# Altium schematic sheet HT1-1-Top.SchDoc: Top
size A3; Author: daniw; SheetNumber: 1; SheetTotal: 10
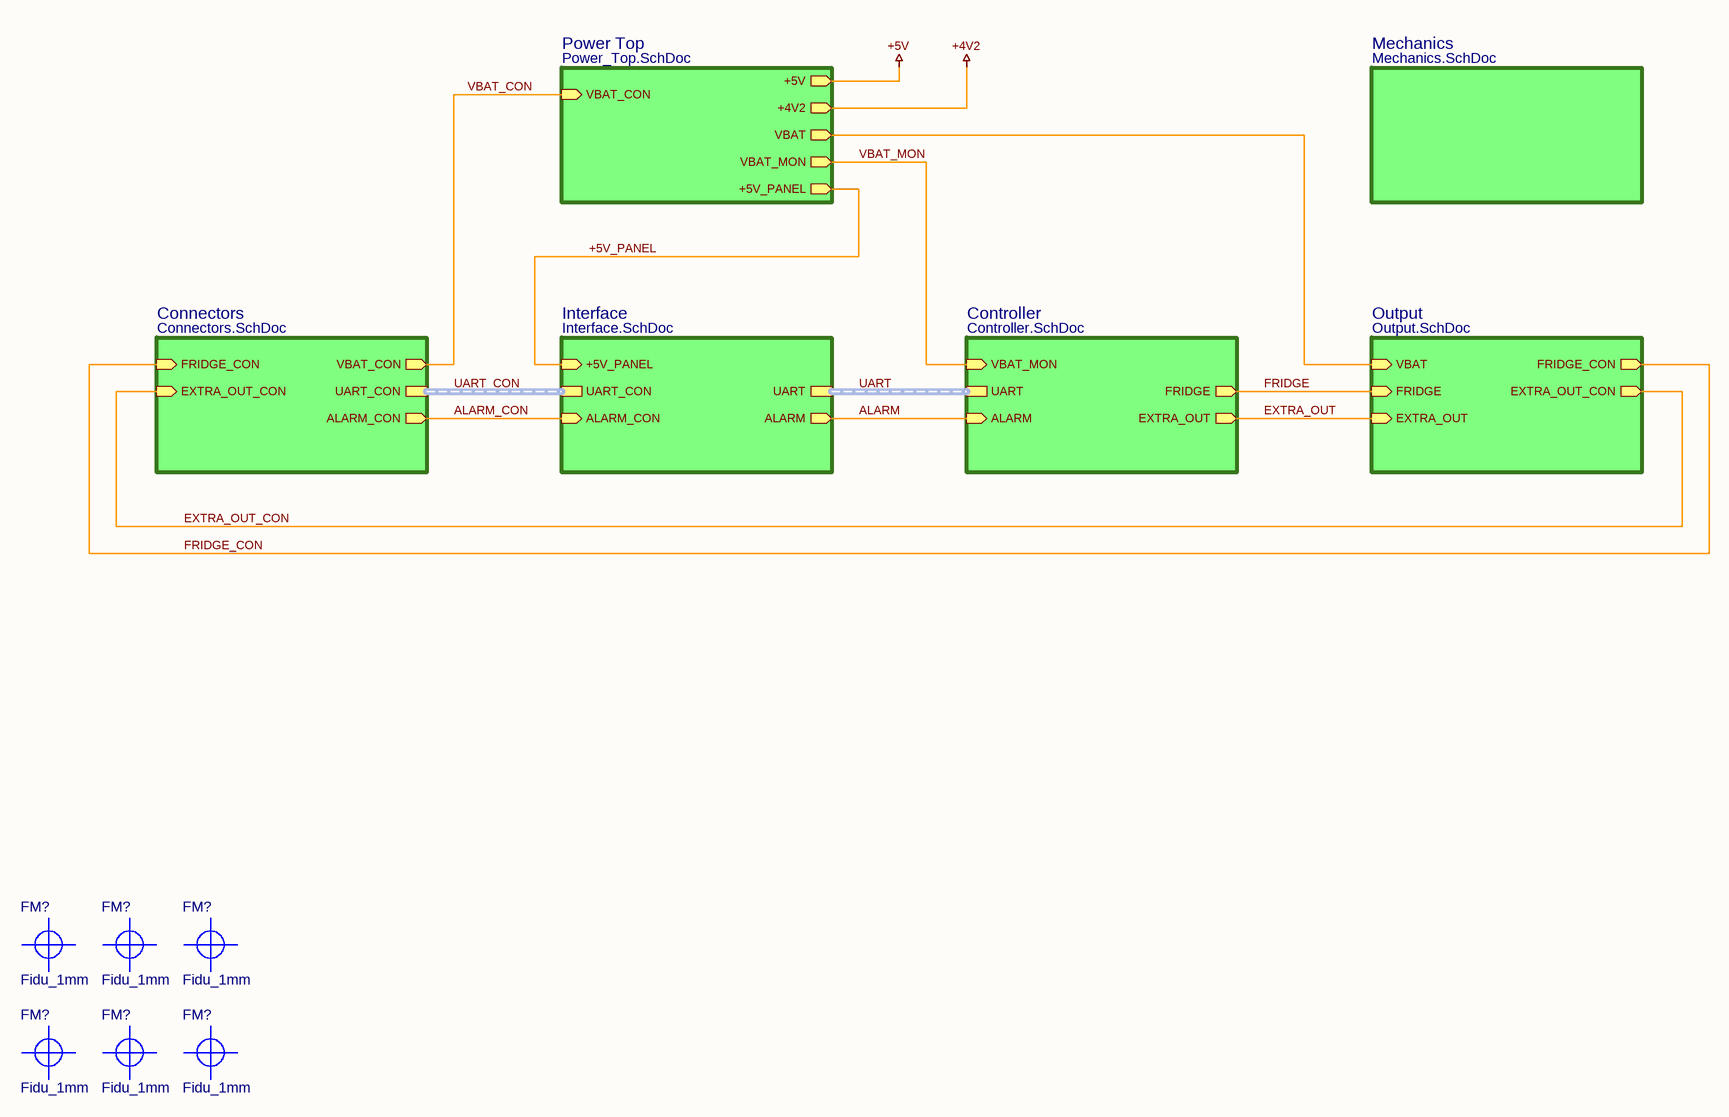
[diagram p0: HT1-1-Top.SchDoc]

## Parts
(Parts that share a designator on the sheet are numbered #1, #2 ... from top to bottom, then left to right.)
FM?#1  Fidu_1mm  [FIDU]  (no BOM)
FM?#2  Fidu_1mm  [FIDU]  (no BOM)
FM?#3  Fidu_1mm  [FIDU]  (no BOM)
FM?#4  Fidu_1mm  [FIDU]  (no BOM)
FM?#5  Fidu_1mm  [FIDU]  (no BOM)
FM?#6  Fidu_1mm  [FIDU]  (no BOM)

## Sub-sheets
Connectors = Connectors.SchDoc: UART_CON (harness UART), ALARM_CON (out), EXTRA_OUT_CON (in), FRIDGE_CON (in), VBAT_CON (out)
Controller = Controller.SchDoc: UART (harness UART), ALARM (in), FRIDGE (out), EXTRA_OUT (out), VBAT_MON (in)
Interface = Interface.SchDoc: UART (harness UART), UART_CON (harness UART), ALARM (out), ALARM_CON (in), +5V_PANEL (in)
Mechanics = Mechanics.SchDoc: no entries
Output = Output.SchDoc: FRIDGE (in), EXTRA_OUT (in), FRIDGE_CON (out), EXTRA_OUT_CON (out), VBAT (in)
Power Top = Power_Top.SchDoc: VBAT_CON (in), +5V (out), +4V2 (out), VBAT_MON (out), +5V_PANEL (out), VBAT (out)

## Nets
+4V2: sheet Power Top/+4V2
+5V: sheet Power Top/+5V
+5V_PANEL: sheet Interface/+5V_PANEL, sheet Power Top/+5V_PANEL
ALARM: sheet Controller/ALARM, sheet Interface/ALARM
ALARM_CON: sheet Interface/ALARM_CON, sheet Connectors/ALARM_CON
EXTRA_OUT: sheet Controller/EXTRA_OUT, sheet Output/EXTRA_OUT
EXTRA_OUT_CON: sheet Output/EXTRA_OUT_CON, sheet Connectors/EXTRA_OUT_CON
FRIDGE: sheet Controller/FRIDGE, sheet Output/FRIDGE
FRIDGE_CON: sheet Output/FRIDGE_CON, sheet Connectors/FRIDGE_CON
VBAT_CON: sheet Power Top/VBAT_CON, sheet Connectors/VBAT_CON
VBAT_MON: sheet Controller/VBAT_MON, sheet Power Top/VBAT_MON
(unnamed): sheet Output/VBAT, sheet Power Top/VBAT

## Buses and harness runs
harness UART = sheet Controller/UART = sheet Interface/UART
harness UART_CON = sheet Connectors/UART_CON = sheet Interface/UART_CON

## Notes on the sheet
- Date:
- Size:
- A3
- Schema:
- Layout:

## Library data of the parts
FM?#1-FM?#6 = Fidu_1mm: Fiducial; Manufacturer: NONE; Part Number: Fidu_1mm